# Altium project PCB_Project1.PrjPCB
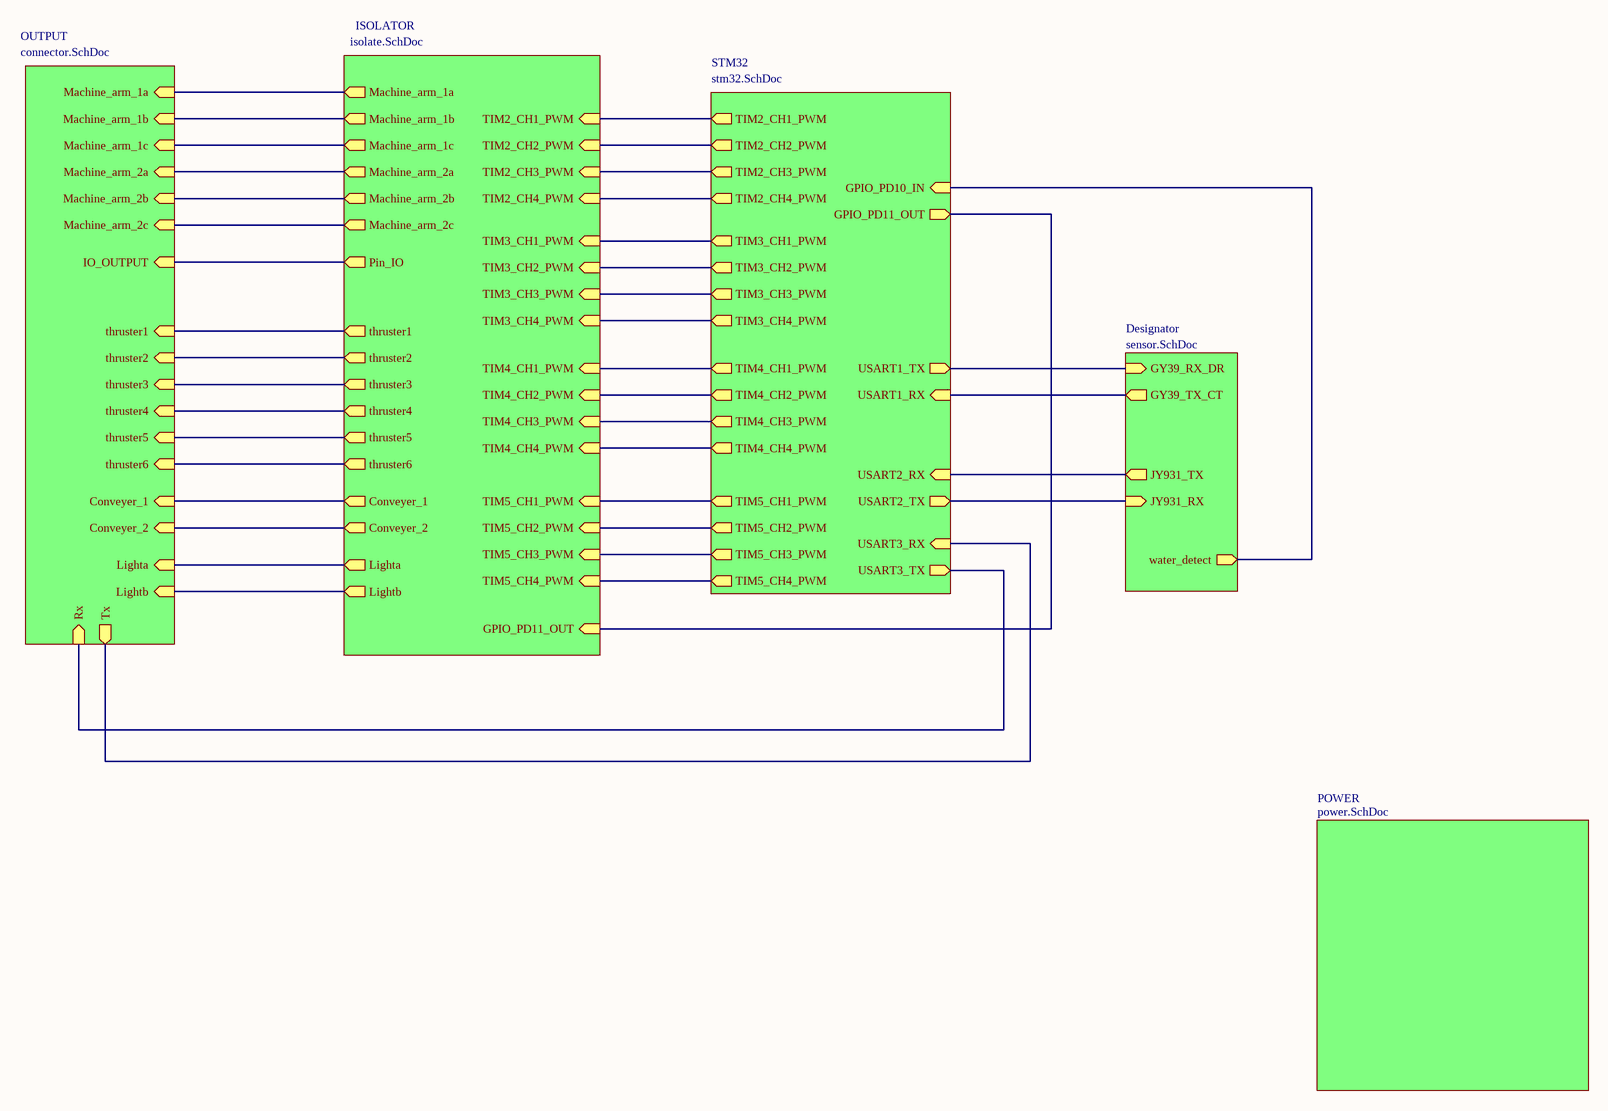
[diagram p0: General.SchDoc]
6 sheets, 63 parts. Net scope: hierarchical (ports join the sheet entries above them; power ports are global).
Board file: PCB1.PcbDoc
Sheets:
  General.SchDoc
    OUTPUT = connector.SchDoc
    STM32 = stm32.SchDoc
    Designator = sensor.SchDoc
    ISOLATOR = isolate.SchDoc
    POWER = power.SchDoc

## Sheet General.SchDoc
size A3

### Sub-sheets
Designator = sensor.SchDoc: water_detect (out), JY931_TX (out), GY39_TX_CT (out), GY39_RX_DR (in), JY931_RX (in)
ISOLATOR = isolate.SchDoc: Machine_arm_1a (out), Machine_arm_2b (out), Machine_arm_1b (out), Machine_arm_1c (out), thruster4 (out), Conveyer_1 (out), Machine_arm_2c (out), Conveyer_2 (out), thruster2 (out), Machine_arm_2a (out), thruster6 (out), thruster3 (out), Lightb (out), TIM2_CH4_PWM (in), thruster5 (out), TIM2_CH3_PWM (in), TIM4_CH3_PWM (in), TIM4_CH1_PWM (in), TIM3_CH2_PWM (in), TIM4_CH4_PWM (in), TIM3_CH1_PWM (in), TIM3_CH3_PWM (in), TIM3_CH4_PWM (in), TIM5_CH3_PWM (in), TIM4_CH2_PWM (in), TIM5_CH2_PWM (in), TIM5_CH4_PWM (in), GPIO_PD11_OUT (in), Pin_IO (out), TIM5_CH1_PWM (in), TIM2_CH2_PWM (in), Lighta (out), TIM2_CH1_PWM (in), thruster1 (out)
OUTPUT = connector.SchDoc: Conveyer_1 (in), Machine_arm_2c (in), Machine_arm_2b (in), Machine_arm_1c (in), thruster6 (in), Machine_arm_1b (in), thruster4 (in), thruster2 (in), Conveyer_2 (in), Machine_arm_1a (in), thruster5 (in), Machine_arm_2a (in), thruster3 (in), thruster1 (in), Tx (out), Rx (in), Lighta (in), Lightb (in), IO_OUTPUT (in)
POWER = power.SchDoc: no entries
STM32 = stm32.SchDoc: TIM2_CH4_PWM (out), TIM5_CH2_PWM (out), TIM2_CH3_PWM (out), USART1_TX (out), TIM5_CH1_PWM (out), USART2_RX (in), TIM3_CH3_PWM (out), GPIO_PD11_OUT (out), USART3_TX (out), TIM4_CH1_PWM (out), USART3_RX (in), TIM2_CH1_PWM (out), TIM3_CH2_PWM (out), TIM3_CH1_PWM (out), USART1_RX (in), GPIO_PD10_IN (in), TIM4_CH2_PWM (out), TIM3_CH4_PWM (out), TIM4_CH3_PWM (out), TIM4_CH4_PWM (out), USART2_TX (out), TIM2_CH2_PWM (out), TIM5_CH4_PWM (out), TIM5_CH3_PWM (out)

### Nets
NetJ1_1: sheet OUTPUT/Machine_arm_1a, sheet ISOLATOR/Machine_arm_1a
NetJ1_2: sheet OUTPUT/Machine_arm_1b, sheet ISOLATOR/Machine_arm_1b
NetJ1_3: sheet OUTPUT/Machine_arm_1c, sheet ISOLATOR/Machine_arm_1c
NetJ2_1: sheet OUTPUT/thruster1, sheet ISOLATOR/thruster1
NetJ3_1: sheet OUTPUT/thruster2, sheet ISOLATOR/thruster2
NetJ4_1: sheet OUTPUT/Machine_arm_2a, sheet ISOLATOR/Machine_arm_2a
NetJ4_2: sheet OUTPUT/Machine_arm_2b, sheet ISOLATOR/Machine_arm_2b
NetJ4_3: sheet OUTPUT/Machine_arm_2c, sheet ISOLATOR/Machine_arm_2c
NetJ5_1: sheet OUTPUT/thruster3, sheet ISOLATOR/thruster3
NetJ6_1: sheet OUTPUT/thruster4, sheet ISOLATOR/thruster4
NetJ7_1: sheet OUTPUT/Conveyer_1, sheet ISOLATOR/Conveyer_1
NetJ7_2: sheet OUTPUT/Conveyer_2, sheet ISOLATOR/Conveyer_2
NetJ8_1: sheet OUTPUT/thruster5, sheet ISOLATOR/thruster5
NetJ9_1: sheet OUTPUT/thruster6, sheet ISOLATOR/thruster6
NetJ11_1: sheet OUTPUT/Rx, sheet STM32/USART3_TX
NetJ11_2: sheet OUTPUT/Tx, sheet STM32/USART3_RX
NetJ12_1: sheet OUTPUT/Lighta, sheet ISOLATOR/Lighta
NetJ14_2: sheet STM32/USART1_TX, sheet Designator/GY39_RX_DR
NetJ14_3: sheet STM32/USART1_RX, sheet Designator/GY39_TX_CT
NetJ16_6: sheet STM32/USART2_TX, sheet Designator/JY931_RX
NetJ16_7: sheet STM32/USART2_RX, sheet Designator/JY931_TX
NetJ19_1: sheet OUTPUT/Lightb, sheet ISOLATOR/Lightb
NetM1_3: sheet STM32/TIM4_CH1_PWM, sheet ISOLATOR/TIM4_CH1_PWM
NetM1_5: sheet STM32/GPIO_PD11_OUT, sheet ISOLATOR/GPIO_PD11_OUT
NetM1_7: sheet STM32/GPIO_PD10_IN, sheet Designator/water_detect
NetM1_11: sheet STM32/TIM2_CH4_PWM, sheet ISOLATOR/TIM2_CH4_PWM
NetM1_12: sheet STM32/TIM2_CH3_PWM, sheet ISOLATOR/TIM2_CH3_PWM
NetM1_23: sheet STM32/TIM3_CH4_PWM, sheet ISOLATOR/TIM3_CH4_PWM
NetM1_26: sheet STM32/TIM3_CH3_PWM, sheet ISOLATOR/TIM3_CH3_PWM
NetM1_27: sheet STM32/TIM3_CH2_PWM, sheet ISOLATOR/TIM3_CH2_PWM
NetM1_29: sheet STM32/TIM2_CH1_PWM, sheet ISOLATOR/TIM2_CH1_PWM
NetM1_31: sheet STM32/TIM5_CH4_PWM, sheet ISOLATOR/TIM5_CH4_PWM
NetM1_33: sheet STM32/TIM5_CH2_PWM, sheet ISOLATOR/TIM5_CH2_PWM
NetM1_34: sheet STM32/TIM5_CH3_PWM, sheet ISOLATOR/TIM5_CH3_PWM
NetM1_36: sheet STM32/TIM5_CH1_PWM, sheet ISOLATOR/TIM5_CH1_PWM
NetM1_48: sheet STM32/TIM3_CH1_PWM, sheet ISOLATOR/TIM3_CH1_PWM
NetM1_49: sheet STM32/TIM4_CH3_PWM, sheet ISOLATOR/TIM4_CH3_PWM
NetM1_50: sheet STM32/TIM4_CH4_PWM, sheet ISOLATOR/TIM4_CH4_PWM
NetM1_52: sheet STM32/TIM4_CH2_PWM, sheet ISOLATOR/TIM4_CH2_PWM
NetM1_60: sheet STM32/TIM2_CH2_PWM, sheet ISOLATOR/TIM2_CH2_PWM
NetR7_2: sheet OUTPUT/IO_OUTPUT, sheet ISOLATOR/Pin_IO

## Sheet connector.SchDoc
size A3
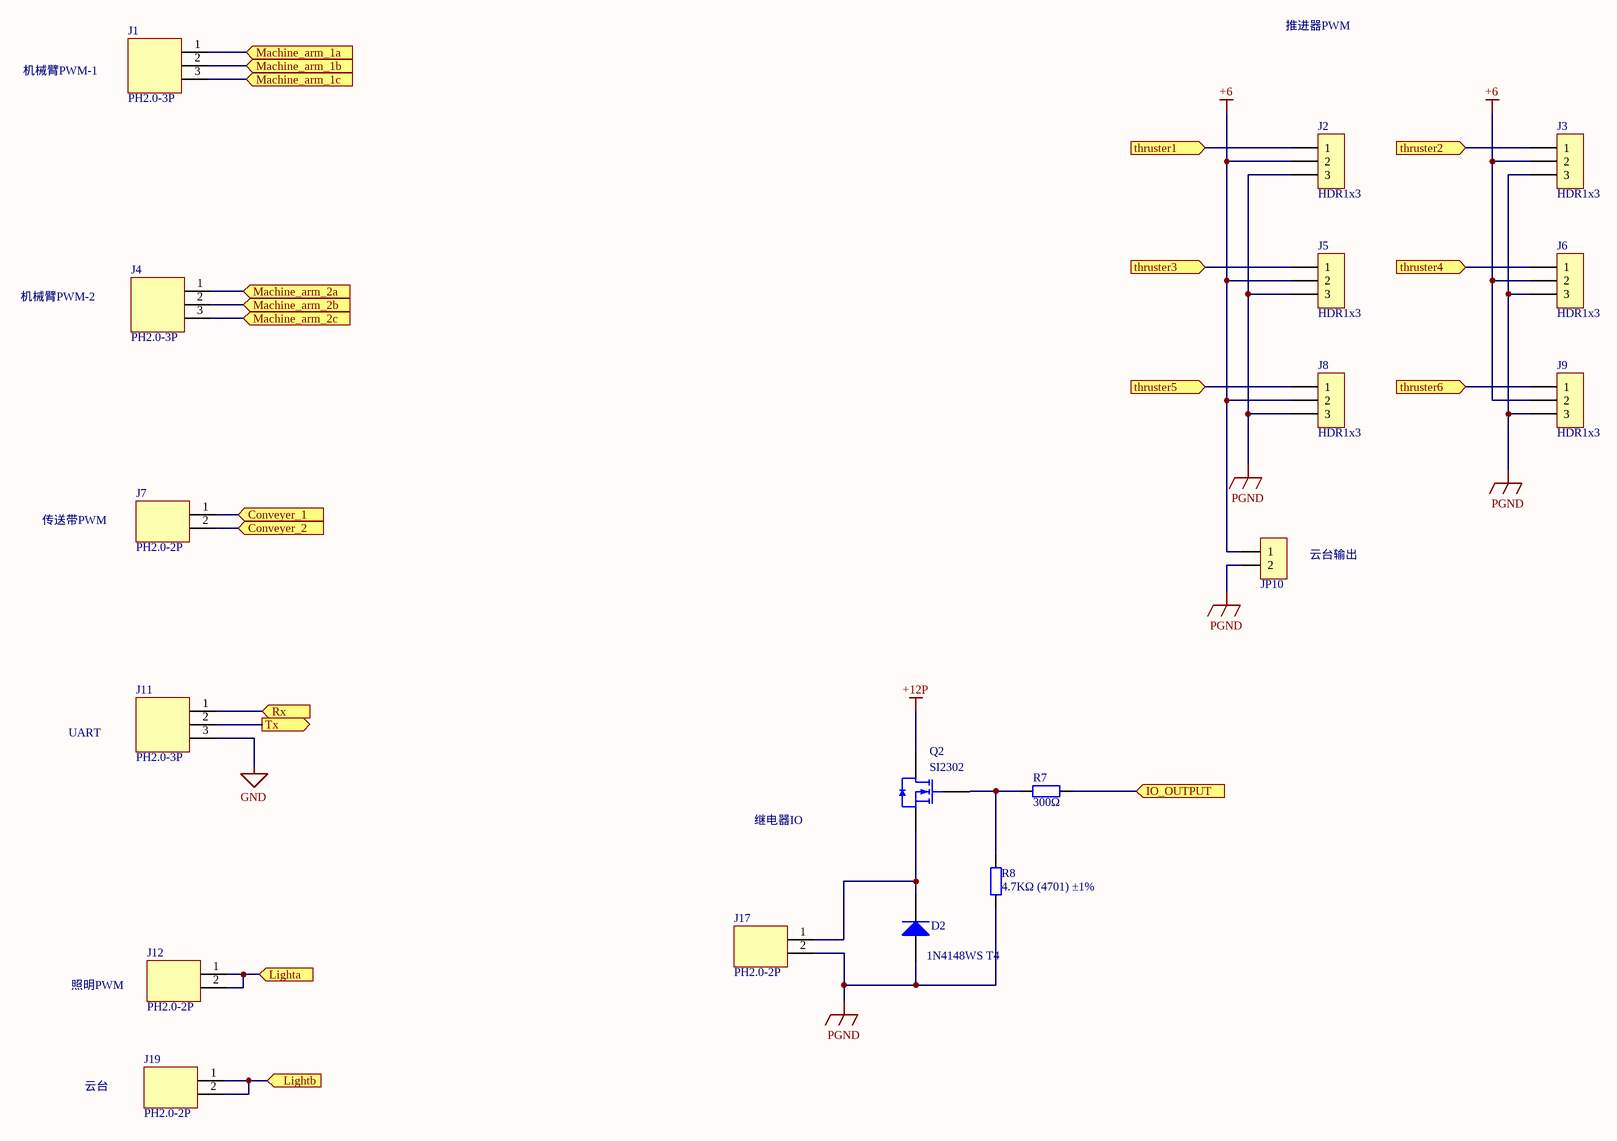
[diagram p1: connector.SchDoc]

### Parts
D2  1N4148WS T4  [SOD-323]
J1  PH2.0-3P  [PH2.0-3P]
J2  HDR1x3  [PIN-3-2.54-1.0]
J3  HDR1x3  [PIN-3-2.54-1.0]
J4  PH2.0-3P  [PH2.0-3P]
J5  HDR1x3  [PIN-3-2.54-1.0]
J6  HDR1x3  [PIN-3-2.54-1.0]
J7  PH2.0-2P  [PH2.0-2P]
J8  HDR1x3  [PIN-3-2.54-1.0]
J9  HDR1x3  [PIN-3-2.54-1.0]
J11  PH2.0-3P  [PH2.0-3P]
J12  PH2.0-2P  [PH2.0-2P]
J17  PH2.0-2P  [PH2.0-2P]
J19  PH2.0-2P  [PH2.0-2P]
JP10  HDR-1X2  [KF128-5.08-2P]  (value not drawn)
Q2  SI2302  [SOT-23(SOT-23-3)]
R7  300Ω  [0603_R]
R8  4.7KΩ (4701) ±1%  [0603_R]

### Ports
Conveyer_1 (in), Conveyer_2 (in), IO_OUTPUT (in), Lighta (in), Lightb (in), Machine_arm_1a (in), Machine_arm_1b (in), Machine_arm_1c (in), Machine_arm_2a (in), Machine_arm_2b (in), Machine_arm_2c (in), Rx (in), thruster1 (in), thruster2 (in), thruster3 (in), thruster4 (in), thruster5 (in), thruster6 (in), Tx (out)

### Nets
+6: J2.2 J3.2 J5.2 J6.2 J8.2 J9.2 JP10.1
+12P: Q2.3(D)
GND: J11.3
PGND: D2.1(A) J2.3 J3.3 J5.3 J6.3 J8.3 J9.3 J17.2 JP10.2 R8.1
NetD2_2: D2.2(K) J17.1 Q2.2(S)
NetJ1_1: J1.1 ; port Machine_arm_1a
NetJ1_2: J1.2 ; port Machine_arm_1b
NetJ1_3: J1.3 ; port Machine_arm_1c
NetJ2_1: J2.1 ; port thruster1
NetJ3_1: J3.1 ; port thruster2
NetJ4_1: J4.1 ; port Machine_arm_2a
NetJ4_2: J4.2 ; port Machine_arm_2b
NetJ4_3: J4.3 ; port Machine_arm_2c
NetJ5_1: J5.1 ; port thruster3
NetJ6_1: J6.1 ; port thruster4
NetJ7_1: J7.1 ; port Conveyer_1
NetJ7_2: J7.2 ; port Conveyer_2
NetJ8_1: J8.1 ; port thruster5
NetJ9_1: J9.1 ; port thruster6
NetJ11_1: J11.1 ; port Rx
NetJ11_2: J11.2 ; port Tx
NetJ12_1: J12.1 J12.2 ; port Lighta
NetJ19_1: J19.1 J19.2 ; port Lightb
NetQ2_1: Q2.1(G) R7.1 R8.2
NetR7_2: R7.2 ; port IO_OUTPUT

### Notes on the sheet
- 机械臂PWM-1
- 推进器PWM
- 机械臂PWM-2
- 传送带PWM
- (near JP10) 云台输出
- UART
- 继电器IO
- 照明PWM
- 云台

### Library data of the parts
D2 = SOD-323 1N4148WS T4: 二极管; ComponentLink1Description: 供应商链接; ComponentLink1URL: http://www.szlcsc.com/product/details_2485.html; Package: SOD-323; Supplier: LC; SuppliersPartNumber: C2128
J2 J3 J5 J6 J8 J9 = HDR1x3: Connector
JP10 = Header 2: 2P接插件; 版权归属: 源创客; BOM名称: 2P接插件; 学习资源: www.ooocke.com
Q2 = 2N7002 7002: MOS(场效应管); ComponentLink1Description: 供应商链接; ComponentLink1URL: http://www.szlcsc.com/product/details_9040.html; Package: SOT-23(SOT-23-3); Supplier: LC; SuppliersPartNumber: C8545
R7 = 0603 10KΩ (1002) 1%: 贴片电阻; ComponentLink1Description: 供应商链接; ComponentLink1URL: http://www.szlcsc.com/product/details_26547.html; Package: 0603; Supplier: LC; SuppliersPartNumber: C25804
R8 = 0603 4.7KΩ (4701) 1%: 贴片电阻; ComponentLink1Description: 供应商链接; ComponentLink1URL: http://www.szlcsc.com/product/details_23889.html; Package: 0603; Supplier: LC; SuppliersPartNumber: C23162

## Sheet stm32.SchDoc
size A3
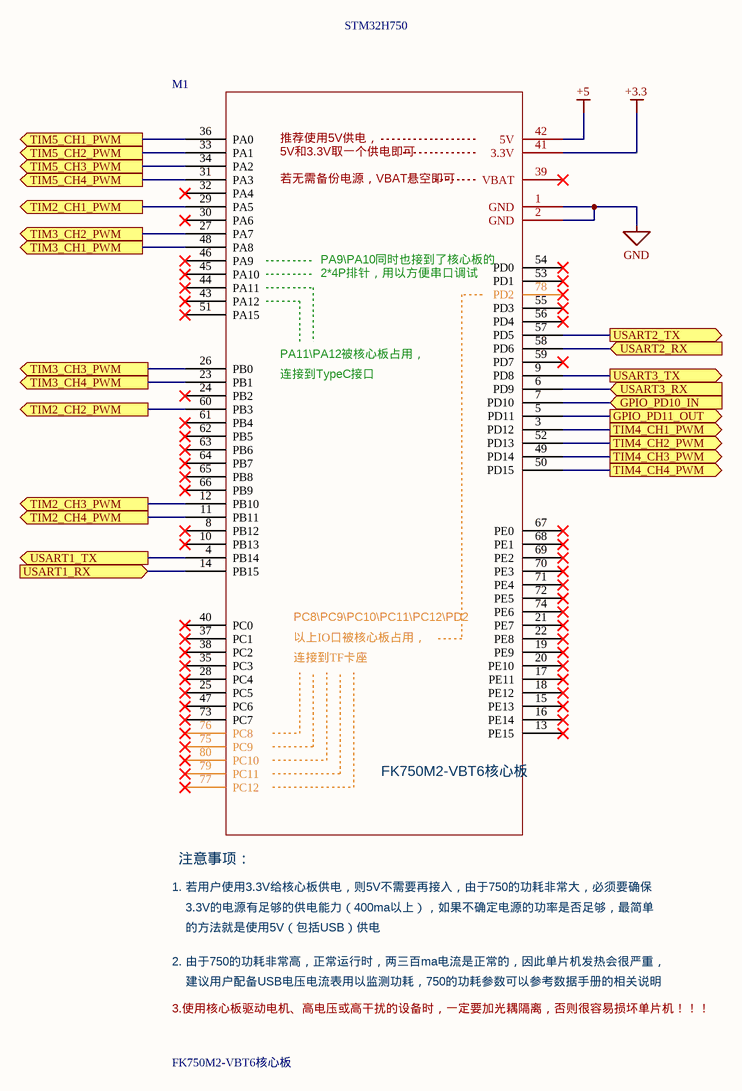
[diagram p2: stm32.SchDoc]

### Parts
M1  FK750M2-VBT6核心板  [FK750M2-VBT6(精简版)]

### Ports
GPIO_PD10_IN (in), GPIO_PD11_OUT (out), TIM2_CH1_PWM (out), TIM2_CH2_PWM (out), TIM2_CH3_PWM (out), TIM2_CH4_PWM (out), TIM3_CH1_PWM (out), TIM3_CH2_PWM (out), TIM3_CH3_PWM (out), TIM3_CH4_PWM (out), TIM4_CH1_PWM (out), TIM4_CH2_PWM (out), TIM4_CH3_PWM (out), TIM4_CH4_PWM (out), TIM5_CH1_PWM (out), TIM5_CH2_PWM (out), TIM5_CH3_PWM (out), TIM5_CH4_PWM (out), USART1_RX (in), USART1_TX (out), USART2_RX (in), USART2_TX (out), USART3_RX (in), USART3_TX (out)

### Nets
+3.3: M1.41(3.3V)
+5: M1.42(5V)
GND: M1.1(GND) M1.2(GND)
NetJ11_1: M1.9(PD8) ; port USART3_TX
NetJ11_2: M1.6(PD9) ; port USART3_RX
NetJ14_2: M1.4(PB14) ; port USART1_TX
NetJ14_3: M1.14(PB15) ; port USART1_RX
NetJ16_6: M1.57(PD5) ; port USART2_TX
NetJ16_7: M1.58(PD6) ; port USART2_RX
NetM1_3: M1.3(PD12) ; port TIM4_CH1_PWM
NetM1_5: M1.5(PD11) ; port GPIO_PD11_OUT
NetM1_7: M1.7(PD10) ; port GPIO_PD10_IN
NetM1_11: M1.11(PB11) ; port TIM2_CH4_PWM
NetM1_12: M1.12(PB10) ; port TIM2_CH3_PWM
NetM1_23: M1.23(PB1) ; port TIM3_CH4_PWM
NetM1_26: M1.26(PB0) ; port TIM3_CH3_PWM
NetM1_27: M1.27(PA7) ; port TIM3_CH2_PWM
NetM1_29: M1.29(PA5) ; port TIM2_CH1_PWM
NetM1_31: M1.31(PA3) ; port TIM5_CH4_PWM
NetM1_33: M1.33(PA1) ; port TIM5_CH2_PWM
NetM1_34: M1.34(PA2) ; port TIM5_CH3_PWM
NetM1_36: M1.36(PA0) ; port TIM5_CH1_PWM
NetM1_48: M1.48(PA8) ; port TIM3_CH1_PWM
NetM1_49: M1.49(PD14) ; port TIM4_CH3_PWM
NetM1_50: M1.50(PD15) ; port TIM4_CH4_PWM
NetM1_52: M1.52(PD13) ; port TIM4_CH2_PWM
NetM1_60: M1.60(PB3) ; port TIM2_CH2_PWM

Not connected (* = marked no-connect by the designer): M1 8(PB12)* 10(PB13)* 13(PE15)* 15(PE13)* 16(PE14)* 17(PE11)* 18(PE12)* 19(PE9)* 20(PE10)* 21(PE7)* 22(PE8)* 24(PB2)* 25(PC5)* 28(PC4)* 30(PA6)* 32(PA4)* 35(PC3)* 37(PC1)* 38(PC2)* 39(VBAT)* 40(PC0)* 43(PA12)* 44(PA11)* 45(PA10)* 46(PA9)* 47(PC6)* 51(PA15)* 53(PD1)* 54(PD0)* 55(PD3)* 56(PD4)* 59(PD7)* 61(PB4)* 62(PB5)* 63(PB6)* 64(PB7)* 65(PB8)* 66(PB9)* 67(PE0)* 68(PE1)* 69(PE2)* 70(PE3)* 71(PE4)* 72(PE5)* 73(PC7)* 74(PE6)* 75(PC9)* 76(PC8)* 77(PC12)* 78(PD2)* 79(PC11)* 80(PC10)*

### Notes on the sheet
- STM32H750
- (in symbol FK750M2-VBT6) 推荐使用5V供电，; 5V和3.3V取一个供电即可; 若无需备份电源，VBAT悬空即可; PA9\PA10同时也接到了核心板的; 2*4P排针，用以方便串口调试; PA11\PA12被核心板占用，; 连接到TypeC接口; PC8\PC9\PC10\PC11\PC12\PD2; 以上IO口被核心板占用，; 连接到TF卡座; 注意事项：; 1. 若用户使用3.3V给核心板供电，则5V不需要再接入，由于750的功耗非常大，必须要确保; 3.3V的电源有足够的供电能力（400ma以上），如果不确定电源的功率是否足够，最简单; 的方法就是使用5V（包括USB）供电; 2. 由于750的功耗非常高，正常运行时，两三百ma电流是正常的，因此单片机发热会很严重，; 建议用户配备USB电压电流表用以监测功耗，750的功耗参数可以参考数据手册的相关说明; 3.使用核心板驱动电机、高电压或高干扰的设备时，一定要加光耦隔离，否则很容易损坏单片机！！！

### Library data of the parts
M1 = FK750M2-VBT6

## Sheet sensor.SchDoc
size A3
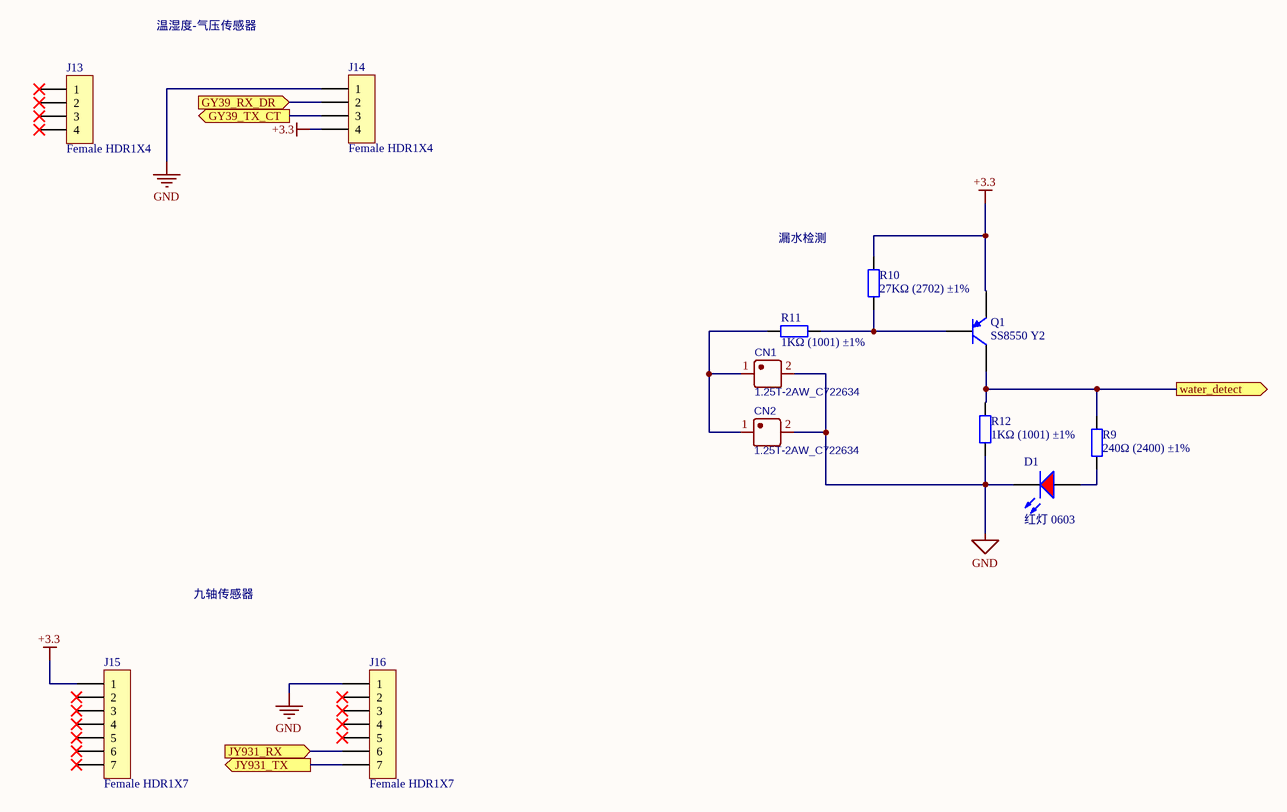
[diagram p3: sensor.SchDoc]

### Parts
CN1  1.25T-2AW_C722634  [GH-1.25]
CN2  1.25T-2AW_C722634  [GH-1.25]
D1  红灯 0603  [0603_LED_S1]
J13  Female HDR1X4  [Fe-HDR1X4/2.54-S]
J14  Female HDR1X4  [Fe-HDR1X4/2.54-S]
J15  Female HDR1X7  [Fe-HDR1X7/2.54-S]
J16  Female HDR1X7  [Fe-HDR1X7/2.54-S]
Q1  SS8550 Y2  [SOT-23(SOT-23-3)]
R9  240Ω (2400) ±1%  [0603_R]
R10  27KΩ (2702) ±1%  [0603_R]
R11  1KΩ (1001) ±1%  [0603_R]
R12  1KΩ (1001) ±1%  [0603_R]

### Ports
GY39_RX_DR (in), GY39_TX_CT (out), JY931_RX (in), JY931_TX (out), water_detect (out)

### Nets
+3.3: J14.4 J15.1 Q1.2(E) R10.2
GND: CN1.2 CN2.2 D1.K J14.1 J16.1 R12.1
NetCN1_1: CN1.1 CN2.1 R11.1
NetD1_A: D1.A R9.1
NetJ14_2: J14.2 ; port GY39_RX_DR
NetJ14_3: J14.3 ; port GY39_TX_CT
NetJ16_6: J16.6 ; port JY931_RX
NetJ16_7: J16.7 ; port JY931_TX
NetM1_7: Q1.3(C) R9.2 R12.2 ; port water_detect
NetQ1_1: Q1.1(B) R10.1 R11.2

Not connected (* = marked no-connect by the designer): J13 1* 2* 3* 4*; J15 2* 3* 4* 5* 6* 7*; J16 2* 3* 4* 5*

### Notes on the sheet
- 温湿度-气压传感器
- 漏水检测
- 九轴传感器

### Library data of the parts
CN1 CN2 = GH 1.25T-2AW_C722634: BOM_Manufacturer: CAX; Contributor: LCSC; BOM_Paste Type: expand; BOM_Supplier: LCSC; BOM_Supplier Part: C722634; BOM_Manufacturer Part: 1.25T-2AW; spicePre: C; spiceSymbolName: 1.25T-2AW_C722634
D1 = 0603 红灯: 发光二极管; ComponentLink1Description: 供应商链接; ComponentLink1URL: http://www.szlcsc.com/product/details_2659.html; Package: 0603; Supplier: LC; SuppliersPartNumber: C2286
Q1 = SOT-23 SS8550 Y2: 三极管; ComponentLink1Description: 供应商链接; ComponentLink1URL: http://www.szlcsc.com/product/details_9037.html; Package: SOT-23; Supplier: LC; SuppliersPartNumber: C8542
R9 = 0603 240Ω (2400) 1%: 贴片电阻; ComponentLink1Description: 供应商链接; ComponentLink1URL: http://www.szlcsc.com/product/details_24083.html; Package: 0603; Supplier: LC; SuppliersPartNumber: C23350
R10 = 0603 27KΩ (2702) 1%: 贴片电阻; ComponentLink1Description: 供应商链接; ComponentLink1URL: http://www.szlcsc.com/product/details_23694.html; Package: 0603; Supplier: LC; SuppliersPartNumber: C22967
R11 R12 = 0603 1KΩ (1001) 1%: 贴片电阻; ComponentLink1Description: 供应商链接; ComponentLink1URL: http://www.szlcsc.com/product/details_21904.html; Package: 0603; Supplier: LC; SuppliersPartNumber: C21190

## Sheet isolate.SchDoc
size A3
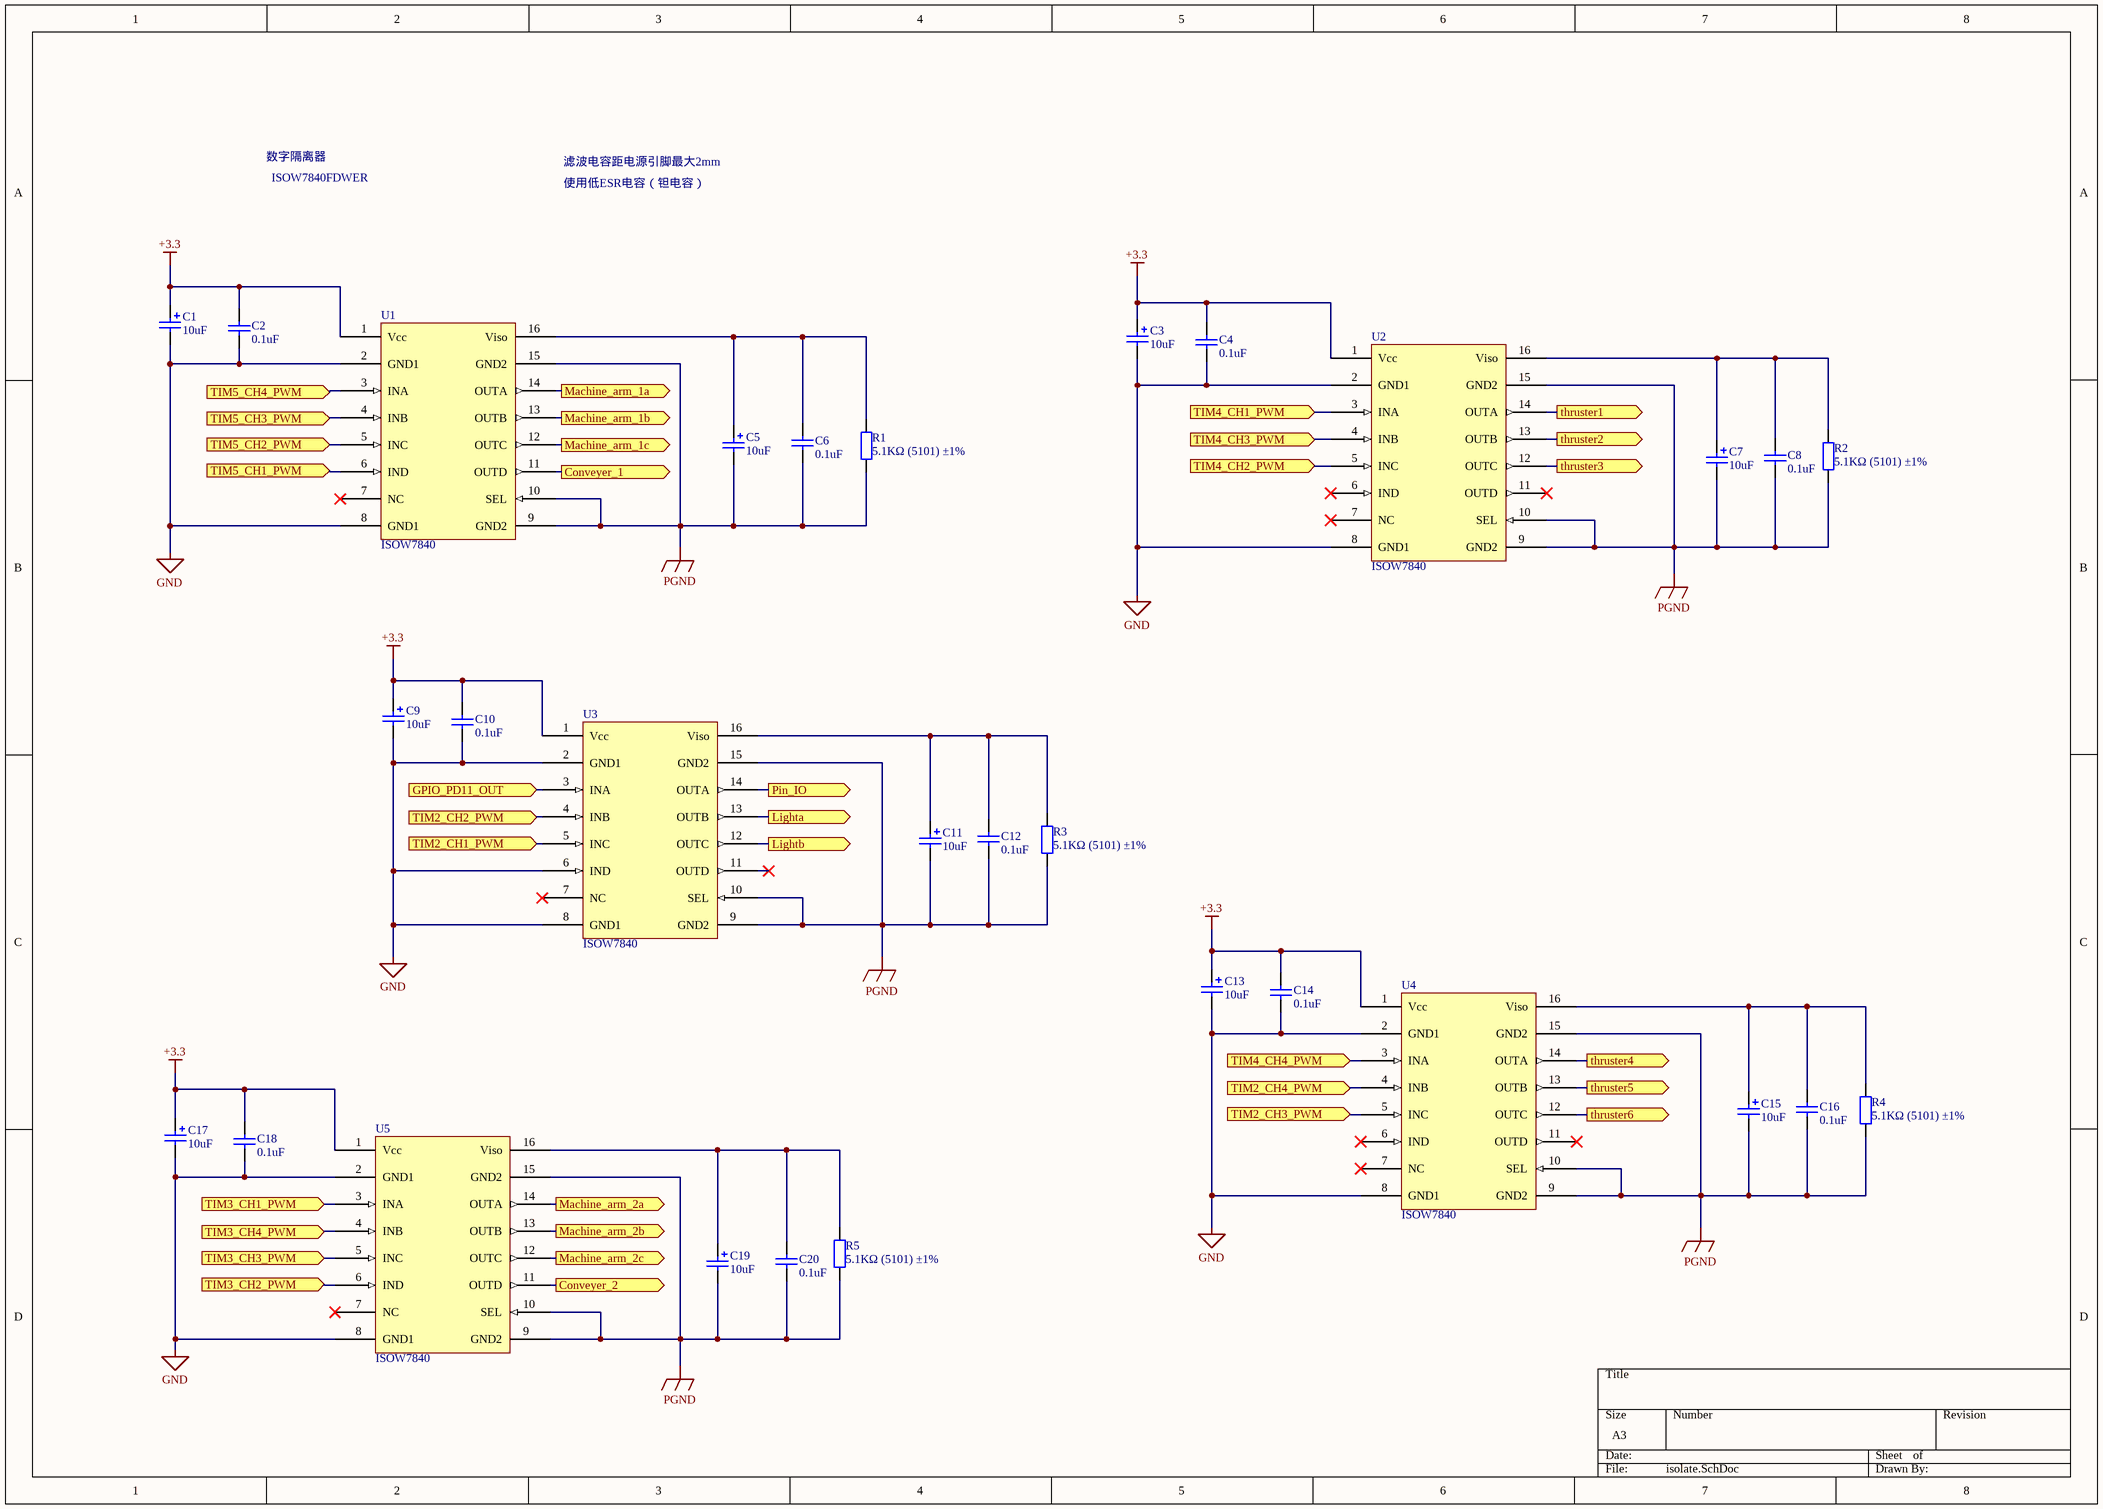
[diagram p4: isolate.SchDoc]

### Parts
C1  10uF  [CASE-B_3528]
C2  0.1uF  [0603_C]
C3  10uF  [CASE-B_3528]
C4  0.1uF  [0603_C]
C5  10uF  [CASE-B_3528]
C6  0.1uF  [0603_C]
C7  10uF  [CASE-B_3528]
C8  0.1uF  [0603_C]
C9  10uF  [CASE-B_3528]
C10  0.1uF  [0603_C]
C11  10uF  [CASE-B_3528]
C12  0.1uF  [0603_C]
C13  10uF  [CASE-B_3528]
C14  0.1uF  [0603_C]
C15  10uF  [CASE-B_3528]
C16  0.1uF  [0603_C]
C17  10uF  [CASE-B_3528]
C18  0.1uF  [0603_C]
C19  10uF  [CASE-B_3528]
C20  0.1uF  [0603_C]
R1  5.1KΩ (5101) ±1%  [0805_R]
R2  5.1KΩ (5101) ±1%  [0805_R]
R3  5.1KΩ (5101) ±1%  [0805_R]
R4  5.1KΩ (5101) ±1%  [0805_R]
R5  5.1KΩ (5101) ±1%  [0805_R]
U1  ISOW7840  [ISOW7840]
U2  ISOW7840  [ISOW7840]
U3  ISOW7840  [ISOW7840]
U4  ISOW7840  [ISOW7840]
U5  ISOW7840  [ISOW7840]

### Ports
Conveyer_1 (out), Conveyer_2 (out), GPIO_PD11_OUT (in), Lighta (out), Lightb (out), Machine_arm_1a (out), Machine_arm_1b (out), Machine_arm_1c (out), Machine_arm_2a (out), Machine_arm_2b (out), Machine_arm_2c (out), Pin_IO (out), thruster1 (out), thruster2 (out), thruster3 (out), thruster4 (out), thruster5 (out), thruster6 (out), TIM2_CH1_PWM (in), TIM2_CH2_PWM (in), TIM2_CH3_PWM (in), TIM2_CH4_PWM (in), TIM3_CH1_PWM (in), TIM3_CH2_PWM (in), TIM3_CH3_PWM (in), TIM3_CH4_PWM (in), TIM4_CH1_PWM (in), TIM4_CH2_PWM (in), TIM4_CH3_PWM (in), TIM4_CH4_PWM (in), TIM5_CH1_PWM (in), TIM5_CH2_PWM (in), TIM5_CH3_PWM (in), TIM5_CH4_PWM (in)

### Nets
+3.3: C1.1 C2.2 C3.1 C4.2 C9.1 C10.2 C13.1 C14.2 C17.1 C18.2 U1.1(Vcc) U2.1(Vcc) U3.1(Vcc) U4.1(Vcc) U5.1(Vcc)
GND: C1.2 C2.1 C3.2 C4.1 C9.2 C10.1 C13.2 C14.1 C17.2 C18.1 U1.2(GND1) U1.8(GND1) U2.2(GND1) U2.8(GND1) U3.2(GND1) U3.6(IND) U3.8(GND1) U4.2(GND1) U4.8(GND1) U5.2(GND1) U5.8(GND1)
PGND: C5.2 C6.1 C7.2 C8.1 C11.2 C12.1 C15.2 C16.1 C19.2 C20.1 R1.1 R2.1 R3.1 R4.1 R5.1 U1.9(GND2) U1.10(SEL) U1.15(GND2) U2.9(GND2) U2.10(SEL) U2.15(GND2) U3.9(GND2) U3.10(SEL) U3.15(GND2) U4.9(GND2) U4.10(SEL) U4.15(GND2) U5.9(GND2) U5.10(SEL) U5.15(GND2)
NetC5_1: C5.1 C6.2 R1.2 U1.16(Viso)
NetC7_1: C7.1 C8.2 R2.2 U2.16(Viso)
NetC11_1: C11.1 C12.2 R3.2 U3.16(Viso)
NetC15_1: C15.1 C16.2 R4.2 U4.16(Viso)
NetC19_1: C19.1 C20.2 R5.2 U5.16(Viso)
NetJ1_1: U1.14(OUTA) ; port Machine_arm_1a
NetJ1_2: U1.13(OUTB) ; port Machine_arm_1b
NetJ1_3: U1.12(OUTC) ; port Machine_arm_1c
NetJ2_1: U2.14(OUTA) ; port thruster1
NetJ3_1: U2.13(OUTB) ; port thruster2
NetJ4_1: U5.14(OUTA) ; port Machine_arm_2a
NetJ4_2: U5.13(OUTB) ; port Machine_arm_2b
NetJ4_3: U5.12(OUTC) ; port Machine_arm_2c
NetJ5_1: U2.12(OUTC) ; port thruster3
NetJ6_1: U4.14(OUTA) ; port thruster4
NetJ7_1: U1.11(OUTD) ; port Conveyer_1
NetJ7_2: U5.11(OUTD) ; port Conveyer_2
NetJ8_1: U4.13(OUTB) ; port thruster5
NetJ9_1: U4.12(OUTC) ; port thruster6
NetJ12_1: U3.13(OUTB) ; port Lighta
NetJ19_1: U3.12(OUTC) ; port Lightb
NetM1_3: U2.3(INA) ; port TIM4_CH1_PWM
NetM1_5: U3.3(INA) ; port GPIO_PD11_OUT
NetM1_11: U4.4(INB) ; port TIM2_CH4_PWM
NetM1_12: U4.5(INC) ; port TIM2_CH3_PWM
NetM1_23: U5.4(INB) ; port TIM3_CH4_PWM
NetM1_26: U5.5(INC) ; port TIM3_CH3_PWM
NetM1_27: U5.6(IND) ; port TIM3_CH2_PWM
NetM1_29: U3.5(INC) ; port TIM2_CH1_PWM
NetM1_31: U1.3(INA) ; port TIM5_CH4_PWM
NetM1_33: U1.5(INC) ; port TIM5_CH2_PWM
NetM1_34: U1.4(INB) ; port TIM5_CH3_PWM
NetM1_36: U1.6(IND) ; port TIM5_CH1_PWM
NetM1_48: U5.3(INA) ; port TIM3_CH1_PWM
NetM1_49: U2.4(INB) ; port TIM4_CH3_PWM
NetM1_50: U4.3(INA) ; port TIM4_CH4_PWM
NetM1_52: U2.5(INC) ; port TIM4_CH2_PWM
NetM1_60: U3.4(INB) ; port TIM2_CH2_PWM
NetR7_2: U3.14(OUTA) ; port Pin_IO

Not connected (* = marked no-connect by the designer): U1 7(NC)*; U2 6(IND)* 7(NC)* 11(OUTD)*; U3 7(NC)* 11(OUTD)*; U4 6(IND)* 7(NC)* 11(OUTD)*; U5 7(NC)*

### Notes on the sheet
- 数字隔离器
- ISOW7840FDWER
- 滤波电容距电源引脚最大2mm
- 使用低ESR电容（钽电容）

### Library data of the parts
C1 C3 C5 C7 C9 C11 C13 C15 C17 C19 = 3528 100uF (107) 10% 6.3V: 钽电容; ComponentLink1Description: 供应商链接; ComponentLink1URL: http://www.szlcsc.com/product/details_16815.html; Package: 3528; Supplier: LC; SuppliersPartNumber: C16133
C2 C4 C6 C8 C10 C12 C14 C16 C18 C20 = 0603 100nF (104) 10% 50V: 贴片电容; ComponentLink1Description: 供应商链接; ComponentLink1URL: http://www.szlcsc.com/product/details_15331.html; Package: 0603; Supplier: LC; SuppliersPartNumber: C14663
R1-R5 = 0805 5.1KΩ (5101) 1%: 贴片电阻; ComponentLink1Description: 供应商链接; ComponentLink1URL: http://www.szlcsc.com/product/details_28584.html; Package: 0805; Supplier: LC; SuppliersPartNumber: C27834

## Sheet power.SchDoc
size A3
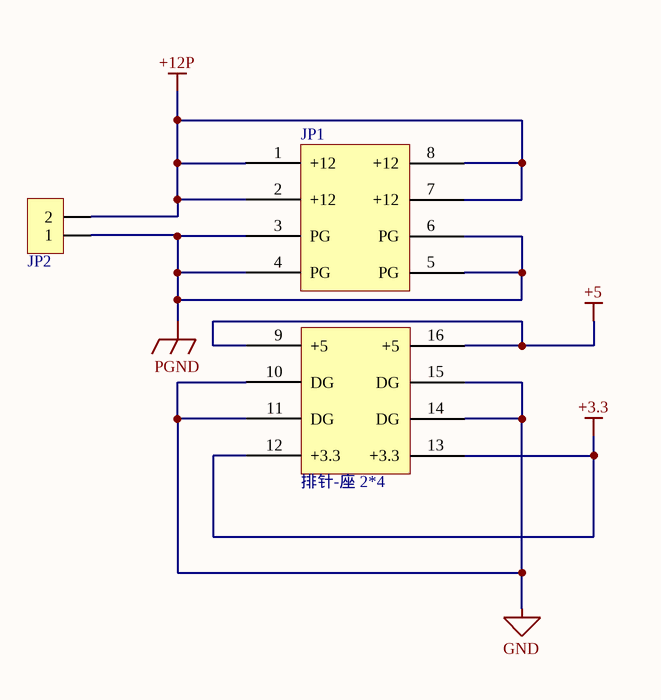
[diagram p5: power.SchDoc]

### Parts
JP1  排针-座 2*4  [排针-座 2*4]
JP2  HDR-1X2  [KF128-5.08-2P]  (value not drawn)

### Nets
+3.3: JP1.12(+3.3) JP1.13(+3.3)
+5: JP1.9(+5) JP1.16(+5)
+12P: JP1.1(+12) JP1.2(+12) JP1.7(+12) JP1.8(+12) JP2.2
GND: JP1.10(DG) JP1.11(DG) JP1.14(DG) JP1.15(DG)
PGND: JP1.3(PG) JP1.4(PG) JP1.5(PG) JP1.6(PG) JP2.1

### Library data of the parts
JP2 = Header 2: 2P接插件; 版权归属: 源创客; BOM名称: 2P接插件; 学习资源: www.ooocke.com

## Nets that join several sheets
+3.3: stm32 (M1.41), sensor (J14.4 J15.1 Q1.2 R10.2), isolate (15 pins), power (JP1.12 JP1.13)
+5: stm32 (M1.42), power (JP1.9 JP1.16)
+12P: connector (Q2.3), power (5 pins)
GND: connector (J11.3), stm32 (M1.1 M1.2), sensor (6 pins), isolate (21 pins), power (JP1.10 JP1.11 JP1.14 JP1.15)
PGND: connector (10 pins), isolate (30 pins), power (5 pins)
NetJ1_1: connector (J1.1), isolate (U1.14)
NetJ1_2: connector (J1.2), isolate (U1.13)
NetJ1_3: connector (J1.3), isolate (U1.12)
NetJ2_1: connector (J2.1), isolate (U2.14)
NetJ3_1: connector (J3.1), isolate (U2.13)
NetJ4_1: connector (J4.1), isolate (U5.14)
NetJ4_2: connector (J4.2), isolate (U5.13)
NetJ4_3: connector (J4.3), isolate (U5.12)
NetJ5_1: connector (J5.1), isolate (U2.12)
NetJ6_1: connector (J6.1), isolate (U4.14)
NetJ7_1: connector (J7.1), isolate (U1.11)
NetJ7_2: connector (J7.2), isolate (U5.11)
NetJ8_1: connector (J8.1), isolate (U4.13)
NetJ9_1: connector (J9.1), isolate (U4.12)
NetJ11_1: connector (J11.1), stm32 (M1.9)
NetJ11_2: connector (J11.2), stm32 (M1.6)
NetJ12_1: connector (J12.1 J12.2), isolate (U3.13)
NetJ14_2: stm32 (M1.4), sensor (J14.2)
NetJ14_3: stm32 (M1.14), sensor (J14.3)
NetJ16_6: stm32 (M1.57), sensor (J16.6)
NetJ16_7: stm32 (M1.58), sensor (J16.7)
NetJ19_1: connector (J19.1 J19.2), isolate (U3.12)
NetM1_3: stm32 (M1.3), isolate (U2.3)
NetM1_5: stm32 (M1.5), isolate (U3.3)
NetM1_7: stm32 (M1.7), sensor (Q1.3 R9.2 R12.2)
NetM1_11: stm32 (M1.11), isolate (U4.4)
NetM1_12: stm32 (M1.12), isolate (U4.5)
NetM1_23: stm32 (M1.23), isolate (U5.4)
NetM1_26: stm32 (M1.26), isolate (U5.5)
NetM1_27: stm32 (M1.27), isolate (U5.6)
NetM1_29: stm32 (M1.29), isolate (U3.5)
NetM1_31: stm32 (M1.31), isolate (U1.3)
NetM1_33: stm32 (M1.33), isolate (U1.5)
NetM1_34: stm32 (M1.34), isolate (U1.4)
NetM1_36: stm32 (M1.36), isolate (U1.6)
NetM1_48: stm32 (M1.48), isolate (U5.3)
NetM1_49: stm32 (M1.49), isolate (U2.4)
NetM1_50: stm32 (M1.50), isolate (U4.3)
NetM1_52: stm32 (M1.52), isolate (U2.5)
NetM1_60: stm32 (M1.60), isolate (U3.4)
NetR7_2: connector (R7.2), isolate (U3.14)